# Altium schematic sheet Principal_Node.SchDoc: Principal_Node
size A; DrawnBy: Project_Vega_Team; Revision: 1; SheetNumber: 4; SheetTotal: 8
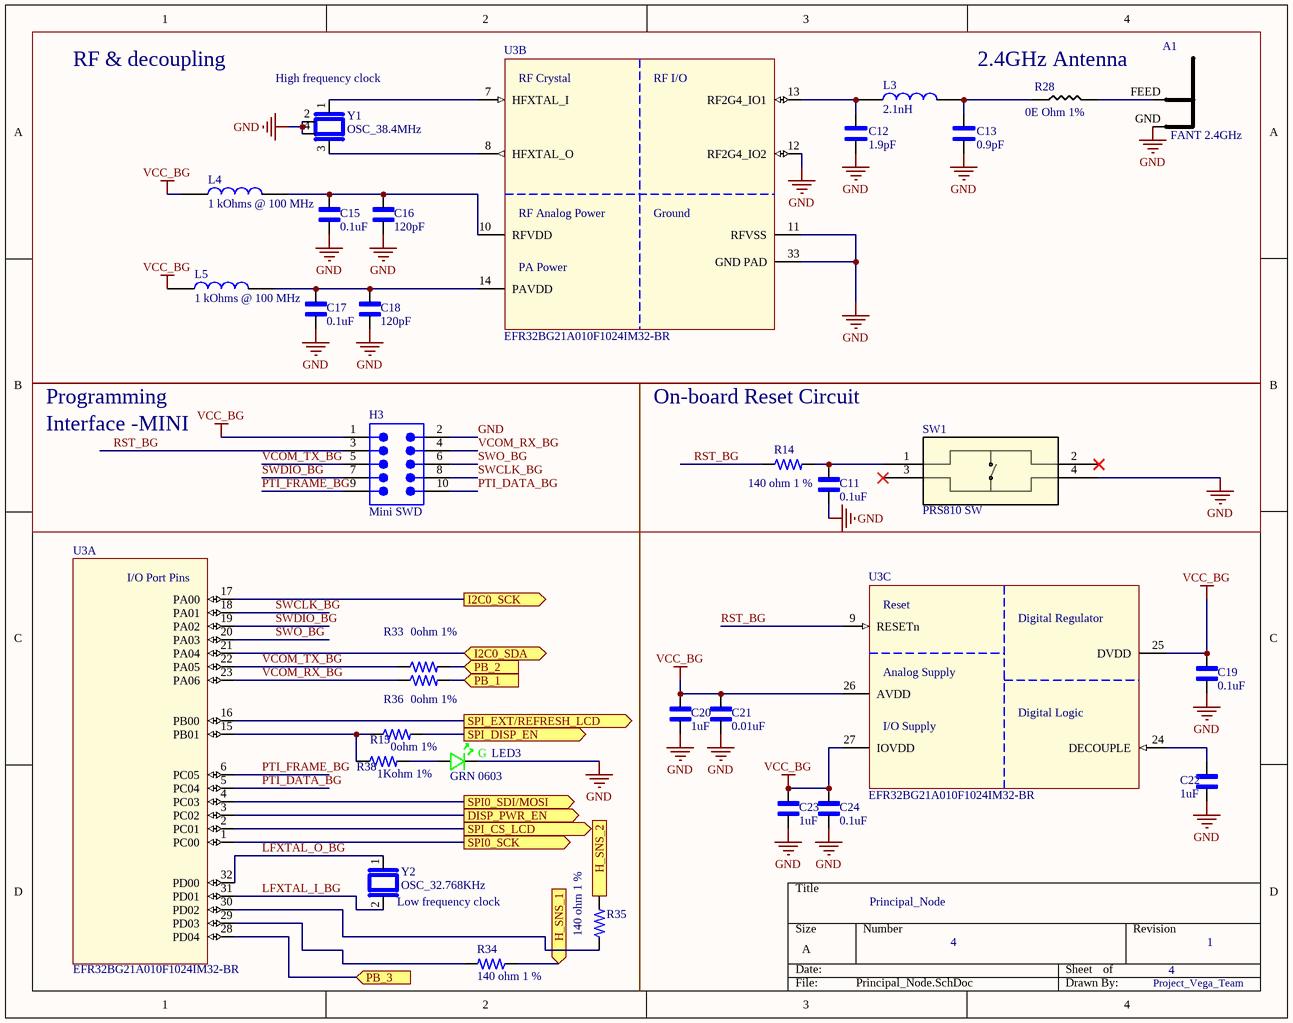
[diagram p0: Principal_Node.SchDoc]

## Parts
A1  FANT 2.4GHz  [FANT_2P4]
C11  0.1uF  [CAPC1608X90]
C12  1.9pF  [0402_Passive_Capacitor]
C13  0.9pF  [0402_Passive_Capacitor]
C15  0.1uF  [CAPC1608X90]
C16  120pF  [CAPC1608X90]
C17  0.1uF  [CAPC1608X90]
C18  120pF  [CAPC1608X90]
C19  0.1uF  [CAPC1608X90]
C20  1uF  [CAPC1608X90]
C21  0.01uF  [CAPC1608X90]
C22  1uF  [CAPC1608X90]
C23  1uF  [CAPC1608X90]
C24  0.1uF  [CAPC1608X90]
H3  Mini SWD  [FTSH-105-01-XXX-DV-K]
L3  2.1nH  [0402_Inductor]
L4  1 kOhms @ 100 MHz  [INDC1608X95N]
L5  1 kOhms @ 100 MHz  [INDC1608X95N]
LED3  GRN 0603  [LED_0603_GRN_WL-SMCW]
R14  140 ohm 1 %  [RES_0603_1608X06]
R15  0ohm 1%  [RES_0603]
R28  0E Ohm 1%  [0402_Passive_Resistor]
R33  0ohm 1%  [RES_0603]
R34  140 ohm 1 %  [RES_0603_1608X06]
R35  140 ohm 1 %  [RES_0603_1608X06]
R36  0ohm 1%  [RES_0603]
R38  1Kohm 1%  [RES_0603]
SW1  PRS810 SW  [PTS810_CNK]
U3  EFR32BG21A010F1024IM32-BR  [QFN32-EFR32xG2xIM32-BR]  (parts A,B,C of 3)  (no BOM)
Y1  OSC_38.4MHz  [OSC_38.4MHz]
Y2  OSC_32.768KHz  [OSC_32.768KHz]

## Ports
DISP_PWR_EN (out, see Input_power[3B]), H_SNS_1 (in, see Input_power[3C]), H_SNS_2 (in, see Input_power[3D]), I2C0_SCK (out, see Project_Node_Sensors[3C]), I2C0_SDA (bidir, see Project_Node_Sensors[2C]), PB_1 (in, see Input_power[2C]), PB_2 (in, see Input_power[2D]), PB_3 (in, see Input_power[2D]), SPI0_SCK (out, see Project_Node_Sensors[1C]), SPI0_SDI/MOSI (out, see Project_Node_Sensors[1C]), SPI_CS_LCD (out, see Project_Node_Sensors[1C]), SPI_DISP_EN (out, see Project_Node_Sensors[1C]), SPI_EXT/REFRESH_LCD (out, see Project_Node_Sensors[1C])

## Nets
GND: A1.GND C11.2 C12.2 C13.2 C15.2 C16.2 C17.2 C18.2 C19.2 C20.2 C21.2 C22.2 C23.2 C24.2 H3.2 LED3.C SW1.4 U3.11(RFVSS) U3.12(RF2G4_IO2) U3.33(GND_PAD) Y1.2 Y1.4
VCC_BG: C19.1 C20.1 C21.1 C23.1 C24.1 H3.1 L4.1 L5.1 U3.25(DVDD) U3.26(AVDD) U3.27(IOVDD)
DISP_PWR_EN: U3.3(PC02) ; port DISP_PWR_EN
H_SNS_1: R34.1 ; port H_SNS_1
H_SNS_2: R35.2 ; port H_SNS_2
I2C0_SCK: U3.17(PA00) ; port I2C0_SCK
I2C0_SDA: U3.21(PA04) ; port I2C0_SDA
LFXTAL_I_BG: U3.31(PD01) Y2.2
LFXTAL_O_BG: U3.32(PD00) Y2.1
PB_1: R36.2 ; port PB_1
PB_2: R33.2 ; port PB_2
PB_3: U3.28(PD04) ; port PB_3
PTI_DATA_BG: H3.10 U3.5(PC04)
PTI_FRAME_BG: H3.9 U3.6(PC05)
RST_BG: H3.3 R14.1 U3.9(RESETn)
SPI0_SCK: U3.1(PC00) ; port SPI0_SCK
SPI0_SDI/MOSI: U3.4(PC03) ; port SPI0_SDI/MOSI
SPI_CS_LCD: U3.2(PC01) ; port SPI_CS_LCD
SPI_DISP_EN: R15.2 ; port SPI_DISP_EN
SPI_EXT/REFRESH_LCD: U3.16(PB00) ; port SPI_EXT/REFRESH_LCD
SWCLK_BG: H3.8 U3.18(PA01)
SWDIO_BG: H3.7 U3.19(PA02)
SWO_BG: H3.6 U3.20(PA03)
VCOM_RX_BG: H3.4 R36.1 U3.23(PA06)
VCOM_TX_BG: H3.5 R33.1 U3.22(PA05)
NetA1_FEED: A1.FEED R28.2
NetC11_1: C11.1 R14.2 SW1.1
NetC12_1: C12.1 L3.1 U3.13(RF2G4_IO1)
NetC13_1: C13.1 L3.2 R28.1
NetC15_1: C15.1 C16.1 L4.2 U3.10(RFVDD)
NetC17_1: C17.1 C18.1 L5.2 U3.14(PAVDD)
NetC22_1: C22.1 U3.24(DECOUPLE)
NetLED3_A: LED3.A R38.2
NetR15_1: R15.1 R38.1 U3.15(PB01)
NetR34_2: R34.2 U3.29(PD03)
NetR35_1: R35.1 U3.30(PD02)
NetU3_7: U3.7(HFXTAL_I) Y1.1
NetU3_8: U3.8(HFXTAL_O) Y1.3

Not connected (* = marked no-connect by the designer): SW1 2* 3*

## Notes on the sheet
- RF & decoupling
- (near Y1) High frequency clock
- (near R28) 2.4GHz Antenna
- Programming
- Interface -MINI
- On-board Reset Circuit
- (near Y2) Low frequency clock
- (in symbol EFR32BG21A010F1024IM32-BR, part A) I/O Port Pins
- (in symbol EFR32BG21A010F1024IM32-BR, part B) RF Crystal; RF I/O; RF Analog Power; Ground; PA Power
- (in symbol EFR32BG21A010F1024IM32-BR, part C) Reset; Digital Regulator; Analog Supply; Digital Logic; I/O Supply
- (in symbol LED_green) G

## Library data of the parts
A1 = FANT_2P4: Inverted F antenna
C11 C15-C24 = CC0603KRX7R9BB104: 0.1 ÂµF Â±10% 50V Ceramic Capacitor X7R 0603 (1608 Metric); MF: Yageo; SnapEDA_Link: https://www.snapeda.com/parts/CC0603KRX7R9BB104/Yageo/view-part/?ref=snap; Package: 0603 Yageo; Value: *; MP: CC0603KRX7R9BB104; Check_prices: https://www.snapeda.com/parts/CC0603KRX7R9BB104/Yageo/view-part/?ref=eda
C12 C13 = C_0402: MULTILAYER CERAMIC CAPACITORS MLCC - SMD/SMT 1UF 25V 0402 ROHS; MFR Part #: CL05A105KA5NQNC; Type: Basic; Datasheet: https://datasheet.lcsc.com/szlcsc/Samsung-Electro-Mechanics-CL05A105KA5NQNC_C52923.pdf; LCSC Part#: C52923; Value: 1uF
H3 = Debug Connector Mini SWD - 0.05": Mini SWD 0.05 Pitch Connector - 10 Pin SMT Box Header | Adafruit Industries 4048; Manufacturer Part Number: 4048; Number of Positions: 10; Supplier 1: Digi-Key; Manufacturer: Adafruit Industries; RoHS: No; Category: Connectors; Stock 1: 201; Pricing 1: 1=1.95000 (USD); ComponentLink1URL: https://media.digikey.com/pdf/Data%20Sheets/Adafruit%20PDFs/4048_Web.pdf?src-supplier=Digi-Key; ComponentLink1Description: https://media.digikey.com/pdf/Data%20Sheets/Adafruit%20PDFs/4048_Web.pdf?src-supplier=Digi-Key; Supplier: Digikey; Supplier Part Number: 1528-2827-ND; Stock: 198; Pricing: 1=1.95 (USD); Mounting Technology: Surface Mount; Contact Shape: Square; Contact Finish - Mating: -; Connector Type: Header; Fastening Type: Pull; Series: -; Contact Type: Male Pin; Number of Rows: 2; Termination: Solder; ComponentLink2URL: https://media.digikey.com/pdf/Data%20Sheets/Adafruit%20PDFs/4048_Web.pdf?src-supplier=Digikey; ComponentLink2Description: https://media.digikey.com/pdf/Data%20Sheets/Adafruit%20PDFs/4048_Web.pdf?src-supplier=Digikey
L3 = IND_0402: Inductor Package 0603; MP: LQM18DN100M70L; MF: Murata Electronics; Price: None; SnapEDA_Link: https://www.snapeda.com/parts/LQM18DN100M70L/Murata/view-part/4834755/?ref=snap; Package: 0603 Murata; Availability: Unavailable; Value: *
L4 L5 = LQM18DN100M70L: Inductor with Inductance 10uH Tol.+/-20% Package 0603 (1608); MF: Murata Electronics; MP: LQM18DN100M70L; Price: None; SnapEDA_Link: https://www.snapeda.com/parts/LQM18DN100M70L/Murata/view-part/4834755/?ref=snap; Package: 0603 Murata; Availability: Unavailable; Value: *
LED3 = LED_green: LED, 0603, GREEN, 430MCD, 520NM; Manufacturer: Wurth Electronics; Manufacturer Part Number: 150060GS75000; Dynamic Catalog: 0603 Rectangle with Flat Top Chip LEDs; 3D Model: SMCW_0603.igs / SMCW_0603.stp / SMCW_0603.wrl; Wavelength - Peak: 515nm; Voltage - Forward (Vf) (Typ): 3.2V; Current - Test: 20mA; Viewing Angle: 140°; Lens Type: Clear; Lens Style/Size: Rectangle with Flat Top, 1.1mm x 0.7mm; Other Names: 732-4971-2; Supplier 1: Digi-Key; Stock 1: 34964; Pricing 1: 1=0.14, 50=0.129, 100=0.11, 500=0.095 (USD); Standard Package: 4,000; Category: Optoelectronics; Family: LED Indication - Discrete; Series: WL-SMCW; Packaging: Tape & Reel (TR); Color: Green; Wavelength - Dominant: 520nm; Millicandela Rating: 430mcd; Package / Case: 0603 (1608 Metric); Size / Dimension: 1.60mm L x 0.80mm W; Height: 0.70mm; Mounting Type: Surface Mount; Online Catalog: 0603 Rectangle with Flat Top Chip LEDs; ComponentLink1URL: https://katalog.we-online.de/led/datasheet/150060GS75000.pdf?src-supplier=Digi-Key; ComponentLink1Description: https://katalog.we-online.de/led/datasheet/150060GS75000.pdf?src-supplier=Digi-Key; ComponentLink2URL: http://www.produktinfo.conrad.com/datenblaetter/750000-774999/759427-da-01-en-CHIPLED_0603_W_KL_GRUEN_150060GS75000.pdf?src-supplier=Conrad; ComponentLink2Description: http://www.produktinfo.conrad.com/datenblaetter/750000-774999/759427-da-01-en-CHIPLED_0603_W_KL_GRUEN_150060GS75000.pdf?src-supplier=Conrad; Supplier Part Number 1: 732-4971-1-ND
R14 R34 R35 = RC0603FR-07140RL: SMD Chip Resistor, 140 Ohm, ± 1%, 100 mW, 0603 [1608 Metric], Thick Film, General Purpose; Manufacturer: Yageo; Value: 140R; Power Rating: 100mW; Voltage Rating: 50V; Temperature Coefficient: 100ppm/°C; Supplier: Digikey; Supplier Part Number: 311-140HRCT-ND; Manufacturer Part Number: RC0603FR-07140RL; RoHS: Yes; Category: Chip SMD Resistors; Stock: 238807; Pricing: 1=0.1, 10=0.019, 50=0.0112, 100=0.0093, 500=0.00622, 1000=0.00532, 5000=0.00382, 10000=0.00335, 25000=0.00287, 35000=0.00278, 50000=0.00257, 125000=0.00232 (USD); Mounting Technology: Surface Mount; Case/Package: 0603; Case Code (Imperial): 0603; Case Code (Metric): 1608; Min Operating Temperature: -55°C; Max Operating Temperature: 155°C; Tolerance: 1%; Packaging: Tape and Reel; Termination: SMD/SMT; Voltage Rating (DC): 50V; Features: Moisture Resistant; Series: RC; Max Power Dissipation: 100mW; Number of Terminations: 2; Construction: Rectangular; Technology: THICK FILM; Length: 1.6mm; Height: 0.45mm; Depth: 0.8mm; Lead Free: Lead Free; RoHS Compliant: Yes; Military Standard: Not; ComponentLink1URL: https://datasheet.ciiva.com/11808/0900766b80c66297-11808828.pdf?src-supplier=Rs; ComponentLink1Description: https://datasheet.ciiva.com/11808/0900766b80c66297-11808828.pdf?src-supplier=Rs; ComponentLink2URL: https://datasheet.ciiva.com/15189/getdatasheetpartid-329205-15189606.pdf?src-supplier=Verical; ComponentLink2Description: https://datasheet.ciiva.com/15189/getdatasheetpartid-329205-15189606.pdf?src-supplier=Verical
R15 R33 R36 R38 = RES_0603: Thick film general purpose resistor 0603; MP: RC0603JR-070RL; Availability: Unavailable; Package: None; Value: *; Price: None
R28 = R_0Ohm_0402: CHIP RESISTOR - SURFACE MOUNT 0OHMS ±1% 1/16W 0402 ROHS; MFR Part #: 0402WGF0000TCE; Value: 0 Ohm; Datasheet: https://datasheet.lcsc.com/szlcsc/Uniroyal-Elec-0402WGF0000TCE_C17168.pdf; LCSC Part#: C17168; Type: Basic
SW1 = PTS810SJM250SMTRLFS: Switch Tactile N.O. SPST Button J-Bend 0.05A 16V 150000Cycles 1.569N SMD T/R; Manufacturer: ITT C&K; Actuator Color: Grey; Operating Force: 160gf; Current Rating: 50mA; Illumination Type: Non-Illuminated; Switch Travel: 0.15mm; Switch Function: Off-Mom; Number of Positions: 2; Actuator Type: Standard; Contact Resistance: 500mR; Supplier: Digikey; Supplier Part Number: CKN10502CT-ND; Manufacturer Part Number: PTS810SJM250SMTRLFS; RoHS: Yes; Stock: 130228; Pricing: 1=0.49, 10=0.474, 25=0.4568, 100=0.3954, 250=0.36028, 500=0.3339, 1000=0.29876, 2900=0.28294, 5800=0.26185, 14500=0.24428 (USD); Mounting Technology: Surface Mount; Case/Package: SMD/SMT; Pins: 4; Mechanical Life: 150000Cycles; Color: Black; Contact Plating: Silver; Min Operating Temperature: -40°C; Max Operating Temperature: 85°C; Throw Configuration: SPST; Packaging: Tape and Reel; Voltage Rating (DC): 16V; Package Quantity: 2900; Series: PTS810; Termination: J-Bend; Max Current Rating: 50mA; Orientation: Straight; Contact Current Rating: 50mA; Length: 3.2mm; Depth: 4.6mm; RoHS Compliant: Yes; Lead Free: Lead Free; ComponentLink1URL: https://datasheet.ciiva.com/24082/pts810-4mar13-248115-24082262.pdf?src-supplier=Mouser; ComponentLink1Description: https://datasheet.ciiva.com/24082/pts810-4mar13-248115-24082262.pdf?src-supplier=Mouser; ComponentLink2URL: https://datasheet.ciiva.com/18514/pts810-4mar13-18514058.pdf?src-supplier=Digikey; ComponentLink2Description: https://datasheet.ciiva.com/18514/pts810-4mar13-18514058.pdf?src-supplier=Digikey; ComponentLink3URL: https://datasheet.ciiva.com/18514/pts810-4mar13-18514059.pdf?src-supplier=Digikey; ComponentLink3Description: https://datasheet.ciiva.com/18514/pts810-4mar13-18514059.pdf?src-supplier=Digikey; ComponentLink4URL: https://datasheet.ciiva.com/18514/pts810-4mar13-18514060.pdf?src-supplier=Digikey; ComponentLink4Description: https://datasheet.ciiva.com/18514/pts810-4mar13-18514060.pdf?src-supplier=Digikey
U3 = EFR32BG21A010F1024IM32-BR: Blue Gecko, QFN32, 2.4G, 10dB, Bluetooth 5.1, 1024kB, 96kB(RAM), 20 GPIO; Manufacturer: Silicon Labs; Supplier: Digikey; Supplier Part Number: 336-5869-1-ND; Manufacturer Part Number: EFR32BG21A010F1024IM32-BR; RoHS: No; Category: RF Receivers, Transceivers; Stock: 38892; Pricing: 1=4.27, 10=3.816, 25=3.4348, 100=3.1293, 250=2.82404, 500=2.6875 (USD); ComponentLink1URL: https://www.silabs.com/documents/login/data-sheets/efr32bg21-datasheet.pdf?src-supplier=Digikey; ComponentLink1Description: https://www.silabs.com/documents/login/data-sheets/efr32bg21-datasheet.pdf?src-supplier=Digikey; ComponentLink2URL: https://datasheet.octopart.com/EFR32BG21A010F1024IM32-BR-Silicon-Labs-datasheet-142046433.pdf?src-supplier=Arrow.cn; ComponentLink2Description: https://datasheet.octopart.com/EFR32BG21A010F1024IM32-BR-Silicon-Labs-datasheet-142046433.pdf?src-supplier=Arrow.cn
Y1 = OSC_38.4MHz: 38.4 MHz ±10ppm Crystal 10pF 40 Ohms 4-SMD, No Lead; MF: {'manufacturer': u'Murata Electronics'}; MP: XRCGB38M400F2P00R0; Package: None; Price: None; Value: *; Availability: Unavailable; Supplier 1: Digikey; Supplier Part Number 1: 4606-TZ3398BCT-ND
Y2 = OSC_32.768KHz: Tuning Fork Crystal 32.768kHz in 1.2 x 2.0mm package; MF: Micro Crystal; MP: CM8V-T1A-32.768KHZ-7PF-20PPM-TA-QC; Package: SMD-2 Micro Crystal; Price: None; Value: *; SnapEDA_Link: https://www.snapeda.com/parts/CM8V-T1A-32.768KHZ-7PF-20PPM-TA-QC/Micro+Crystal/view-part/?ref=snap; Availability: Not in stock; Check_prices: https://www.snapeda.com/parts/CM8V-T1A-32.768KHZ-7PF-20PPM-TA-QC/Micro+Crystal/view-part/?ref=eda; Supplier 1: Digikey; Supplier Part Number 1: 2195-CM8V-T1A-32.768KHZ-7PF-20PPM-TA-QCCT-ND